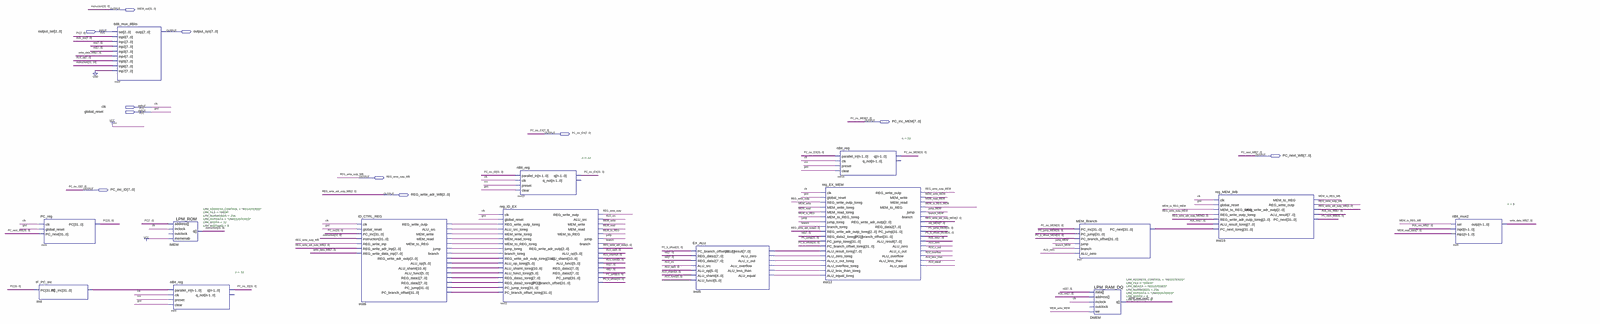
[diagram p0: schematic sheet, whole]
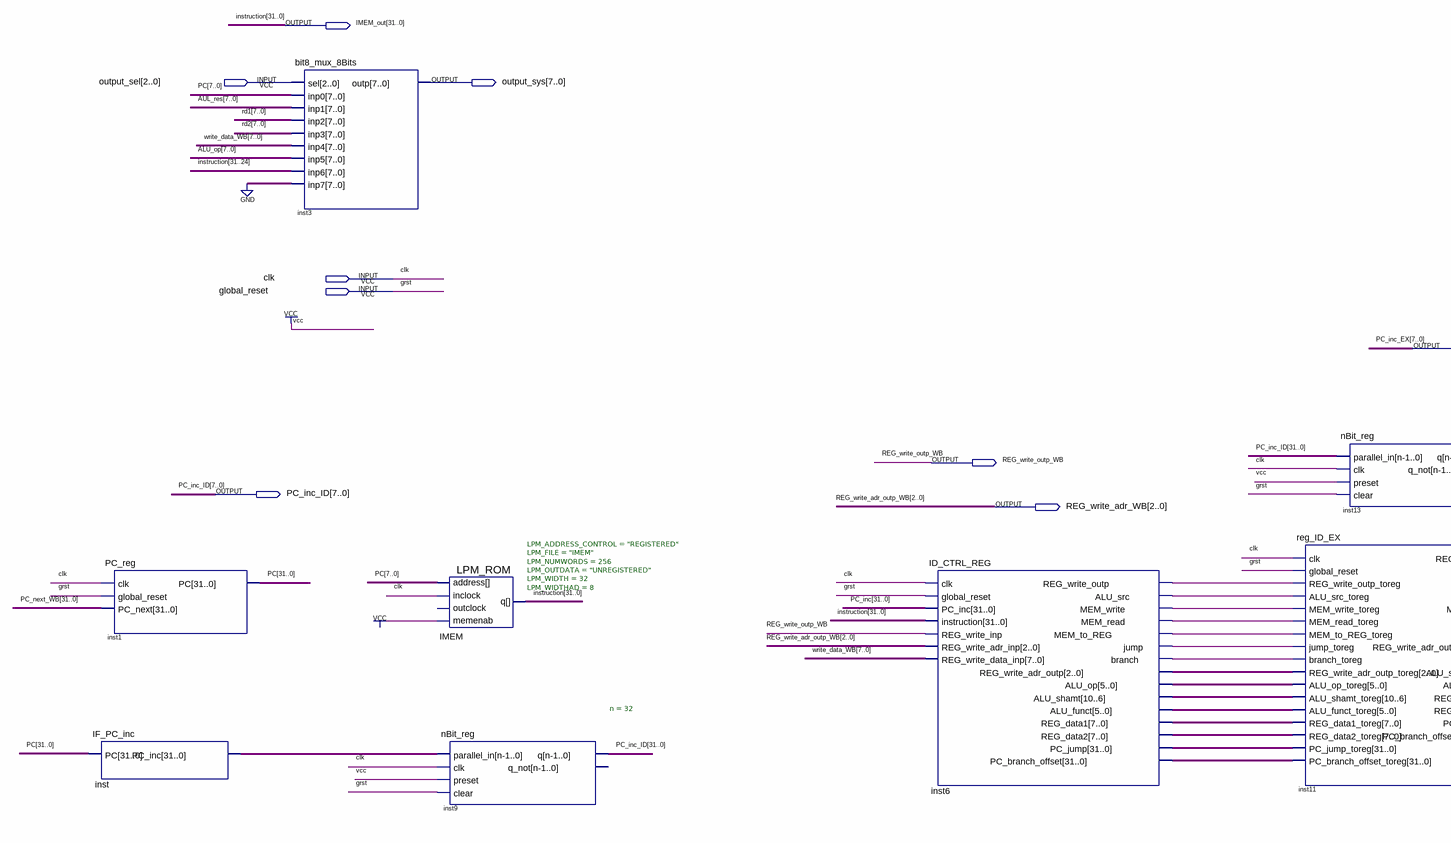
[diagram p1: schematic sheet, left part]
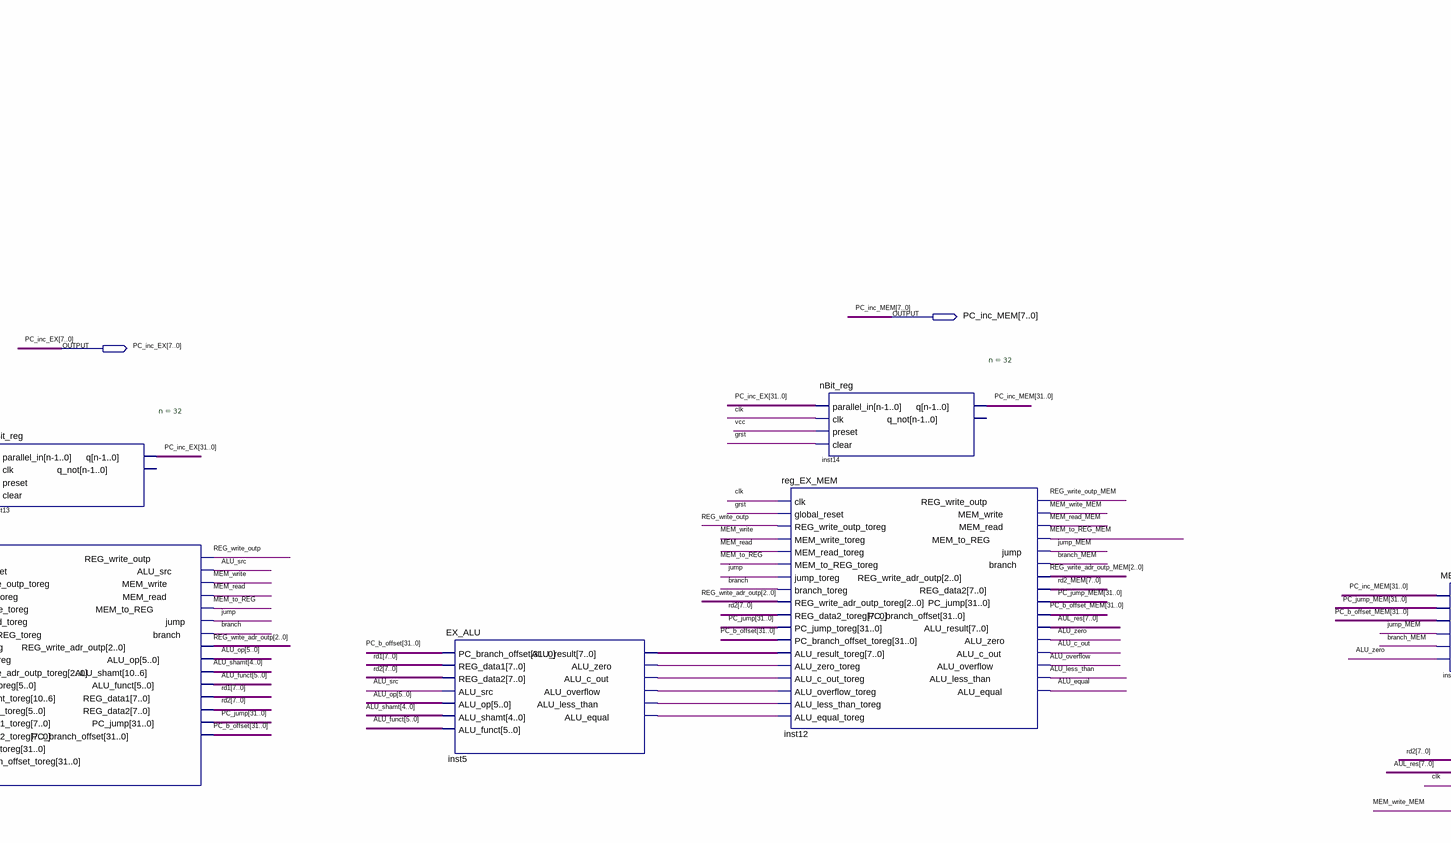
[diagram p2: schematic sheet, centre part]
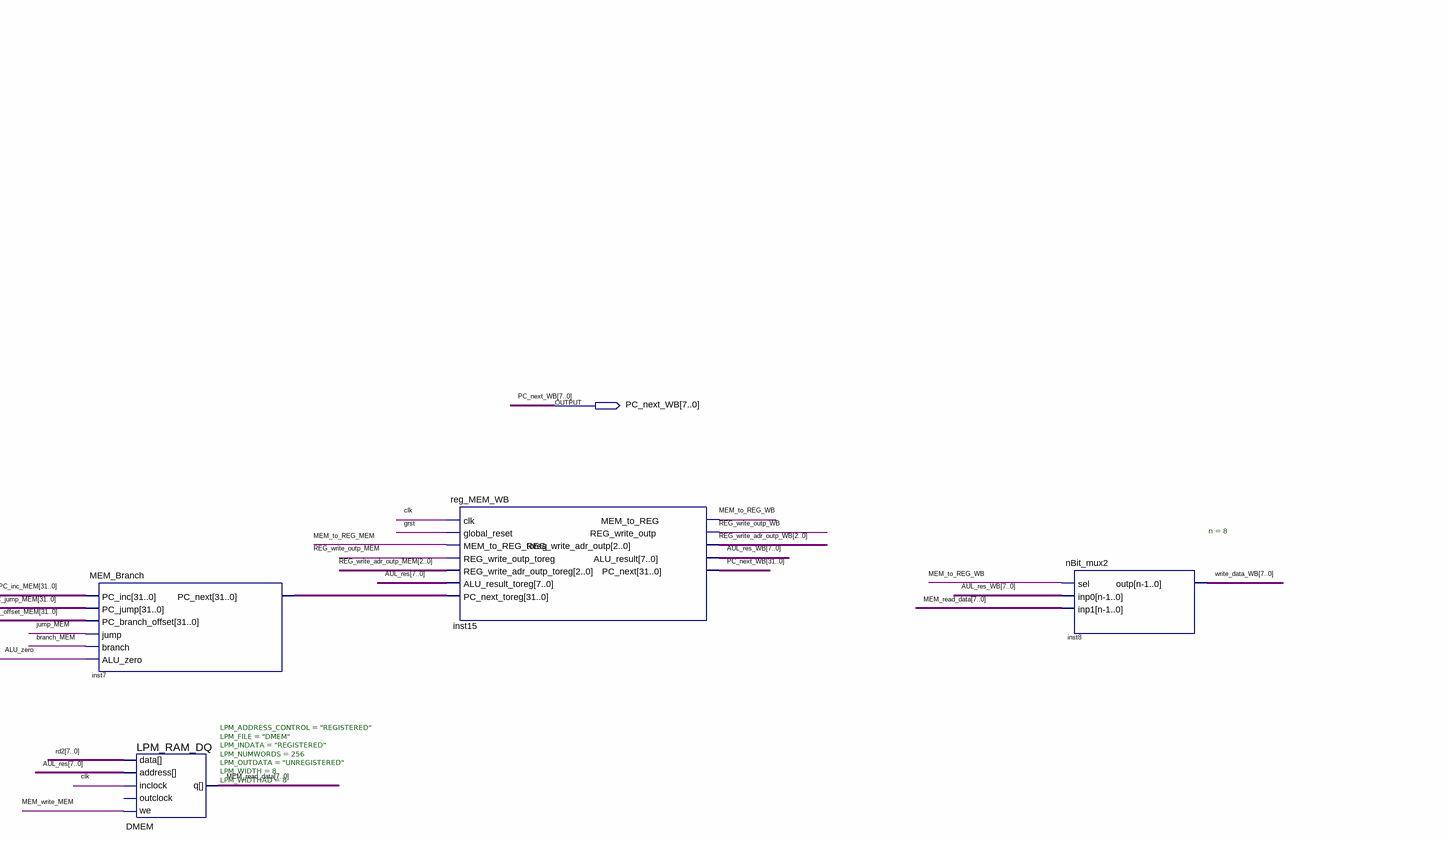
[diagram p3: schematic sheet, right part]
// Quartus schematic top_level.bdf as structural Verilog: 15 symbols, 11 pins
module top_level (
  input  [2:0] output_sel,
  input  clk,
  input  global_reset,
  output [31:0] IMEM_out,
  output [7:0] output_sys,
  output [31:0] PC_inc_MEM,
  output [31:0] PC_inc_EX,
  output [31:0] PC_next_WB,
  output REG_write_outp_WB,
  output [31:0] PC_inc_ID,
  output [2:0] REG_write_adr_WB
);

  wire ALU_c_out, ALU_equal, ALU_less_than, ALU_overflow, ALU_src, ALU_zero, branch, branch_MEM,
       inst5_alu_c_out, inst5_alu_equal, inst5_alu_less_than, inst5_alu_overflow, inst5_alu_zero,
       inst6_alu_src, inst6_branch, inst6_jump, inst6_mem_read, inst6_mem_to_reg, inst6_mem_write,
       inst6_reg_write_outp, jump, jump_MEM, MEM_read, MEM_read_MEM, MEM_to_REG, MEM_to_REG_MEM,
       MEM_to_REG_WB, MEM_write, MEM_write_MEM, REG_write_outp, REG_write_outp_MEM;
  wire [2:0] inst6_reg_write_adr_outp, REG_write_adr_outp, REG_write_adr_outp_MEM;
  wire [4:0] ALU_shamt, inst6_alu_shamt;
  wire [5:0] ALU_funct, inst6_alu_funct, inst6_alu_op;
  wire [7:0] ALU_op, AUL_res, AUL_res_WB, inst5_alu_result, inst6_reg_data1, inst6_reg_data2, MEM_read_data,
       rd1, rd2, rd2_MEM, write_data_WB;
  wire [31:0] inst6_pc_branch_offset, inst6_pc_jump, inst7_pc_next, inst_pc_inc, PC, PC_b_offset,
       PC_b_offset_MEM, PC_inc, PC_jump, PC_jump_MEM;

  IF_PC_inc inst (.PC(PC), .PC_inc(inst_pc_inc));
  PC_reg inst1 (.clk(clk), .global_reset(global_reset), .PC_next(PC_next_WB), .PC(PC));
  bit8_mux_8Bits inst3 (
    .sel(output_sel), .inp0(PC[7:0]), .inp1(AUL_res), .inp2(rd1), .inp3(rd2), .inp4(write_data_WB),
    .inp5(ALU_op), .inp6(IMEM_out[31:24]), .inp7({8{1'b0}}), .outp(output_sys));
  LPM_ROM #(.LPM_ADDRESS_CONTROL("REGISTERED"), .LPM_FILE("IMEM"), .LPM_NUMWORDS(256), .LPM_OUTDATA("UNREGISTERED"), .LPM_WIDTH(32), .LPM_WIDTHAD(8)) IMEM (
    .address(PC[7:0]), .inclock(clk), .memenab(1'b1), .q(IMEM_out));  // open: outclock
  nBit_reg #(.n(32)) inst9 (
    .parallel_in(inst_pc_inc), .clk(clk), .preset(1'b1), .clear(global_reset), .q(PC_inc_ID));  // open: q_not
  ID_CTRL_REG inst6 (
    .clk(clk), .global_reset(global_reset), .PC_inc(PC_inc), .instruction(IMEM_out),
    .REG_write_inp(REG_write_outp_WB), .REG_write_adr_inp(REG_write_adr_WB),
    .REG_write_data_inp(write_data_WB), .REG_write_outp(inst6_reg_write_outp), .ALU_src(inst6_alu_src),
    .MEM_write(inst6_mem_write), .MEM_read(inst6_mem_read), .MEM_to_REG(inst6_mem_to_reg), .jump(inst6_jump),
    .branch(inst6_branch), .REG_write_adr_outp(inst6_reg_write_adr_outp), .ALU_op(inst6_alu_op),
    .ALU_shamt(inst6_alu_shamt), .ALU_funct(inst6_alu_funct), .REG_data1(inst6_reg_data1),
    .REG_data2(inst6_reg_data2), .PC_jump(inst6_pc_jump), .PC_branch_offset(inst6_pc_branch_offset));
  reg_ID_EX inst11 (
    .clk(clk), .global_reset(global_reset), .REG_write_outp_toreg(inst6_reg_write_outp),
    .ALU_src_toreg(inst6_alu_src), .MEM_write_toreg(inst6_mem_write), .MEM_read_toreg(inst6_mem_read),
    .MEM_to_REG_toreg(inst6_mem_to_reg), .jump_toreg(inst6_jump), .branch_toreg(inst6_branch),
    .REG_write_adr_outp_toreg(inst6_reg_write_adr_outp), .ALU_op_toreg(inst6_alu_op),
    .ALU_shamt_toreg(inst6_alu_shamt), .ALU_funct_toreg(inst6_alu_funct), .REG_data1_toreg(inst6_reg_data1),
    .REG_data2_toreg(inst6_reg_data2), .PC_jump_toreg(inst6_pc_jump),
    .PC_branch_offset_toreg(inst6_pc_branch_offset), .REG_write_outp(REG_write_outp), .ALU_src(ALU_src),
    .MEM_write(MEM_write), .MEM_read(MEM_read), .MEM_to_REG(MEM_to_REG), .jump(jump), .branch(branch),
    .REG_write_adr_outp(REG_write_adr_outp), .ALU_op(ALU_op[5:0]), .ALU_shamt(ALU_shamt),
    .ALU_funct(ALU_funct), .REG_data1(rd1), .REG_data2(rd2), .PC_jump(PC_jump), .PC_branch_offset(PC_b_offset));
  nBit_reg #(.n(32)) inst13 (
    .parallel_in(PC_inc_ID), .clk(clk), .preset(1'b1), .clear(global_reset), .q(PC_inc_EX));  // open: q_not
  EX_ALU inst5 (
    .PC_branch_offset(PC_b_offset), .REG_data1(rd1), .REG_data2(rd2), .ALU_src(ALU_src),
    .ALU_op(ALU_op[5:0]), .ALU_shamt(ALU_shamt), .ALU_funct(ALU_funct), .ALU_result(inst5_alu_result),
    .ALU_zero(inst5_alu_zero), .ALU_c_out(inst5_alu_c_out), .ALU_overflow(inst5_alu_overflow),
    .ALU_less_than(inst5_alu_less_than), .ALU_equal(inst5_alu_equal));
  nBit_reg #(.n(32)) inst14 (
    .parallel_in(PC_inc_EX), .clk(clk), .preset(1'b1), .clear(global_reset), .q(PC_inc_MEM));  // open: q_not
  reg_EX_MEM inst12 (
    .clk(clk), .global_reset(global_reset), .REG_write_outp_toreg(REG_write_outp),
    .MEM_write_toreg(MEM_write), .MEM_read_toreg(MEM_read), .MEM_to_REG_toreg(MEM_to_REG), .jump_toreg(jump),
    .branch_toreg(branch), .REG_write_adr_outp_toreg(REG_write_adr_outp), .REG_data2_toreg(rd2),
    .PC_jump_toreg(PC_jump), .PC_branch_offset_toreg(PC_b_offset), .ALU_result_toreg(inst5_alu_result),
    .ALU_zero_toreg(inst5_alu_zero), .ALU_c_out_toreg(inst5_alu_c_out),
    .ALU_overflow_toreg(inst5_alu_overflow), .ALU_less_than_toreg(inst5_alu_less_than),
    .ALU_equal_toreg(inst5_alu_equal), .REG_write_outp(REG_write_outp_MEM), .MEM_write(MEM_write_MEM),
    .MEM_read(MEM_read_MEM), .MEM_to_REG(MEM_to_REG_MEM), .jump(jump_MEM), .branch(branch_MEM),
    .REG_write_adr_outp(REG_write_adr_outp_MEM), .REG_data2(rd2_MEM), .PC_jump(PC_jump_MEM),
    .PC_branch_offset(PC_b_offset_MEM), .ALU_result(AUL_res), .ALU_zero(ALU_zero), .ALU_c_out(ALU_c_out),
    .ALU_overflow(ALU_overflow), .ALU_less_than(ALU_less_than), .ALU_equal(ALU_equal));
  MEM_Branch inst7 (
    .PC_inc(PC_inc_MEM), .PC_jump(PC_jump_MEM), .PC_branch_offset(PC_b_offset_MEM), .jump(jump_MEM),
    .branch(branch_MEM), .ALU_zero(ALU_zero), .PC_next(inst7_pc_next));
  LPM_RAM_DQ #(.LPM_ADDRESS_CONTROL("REGISTERED"), .LPM_FILE("DMEM"), .LPM_INDATA("REGISTERED"), .LPM_NUMWORDS(256), .LPM_OUTDATA("UNREGISTERED"), .LPM_WIDTH(8), .LPM_WIDTHAD(8)) DMEM (
    .inclock(clk), .data(rd2), .address(AUL_res), .we(MEM_write_MEM), .q(MEM_read_data));  // open: outclock
  reg_MEM_WB inst15 (
    .clk(clk), .global_reset(global_reset), .MEM_to_REG_toreg(MEM_to_REG_MEM),
    .REG_write_outp_toreg(REG_write_outp_MEM), .REG_write_adr_outp_toreg(REG_write_adr_outp_MEM),
    .ALU_result_toreg(AUL_res), .PC_next_toreg(inst7_pc_next), .MEM_to_REG(MEM_to_REG_WB),
    .REG_write_outp(REG_write_outp_WB), .REG_write_adr_outp(REG_write_adr_WB), .ALU_result(AUL_res_WB),
    .PC_next(PC_next_WB));
  nBit_mux2 #(.n(8)) inst8 (.sel(MEM_to_REG_WB), .inp0(AUL_res_WB), .inp1(MEM_read_data), .outp(write_data_WB));

  // Other names for the same wires on the sheet: grst = global_reset; instruction[31:0] = IMEM_out;
  //   REG_write_adr_outp_WB[2:0] = REG_write_adr_WB
endmodule
